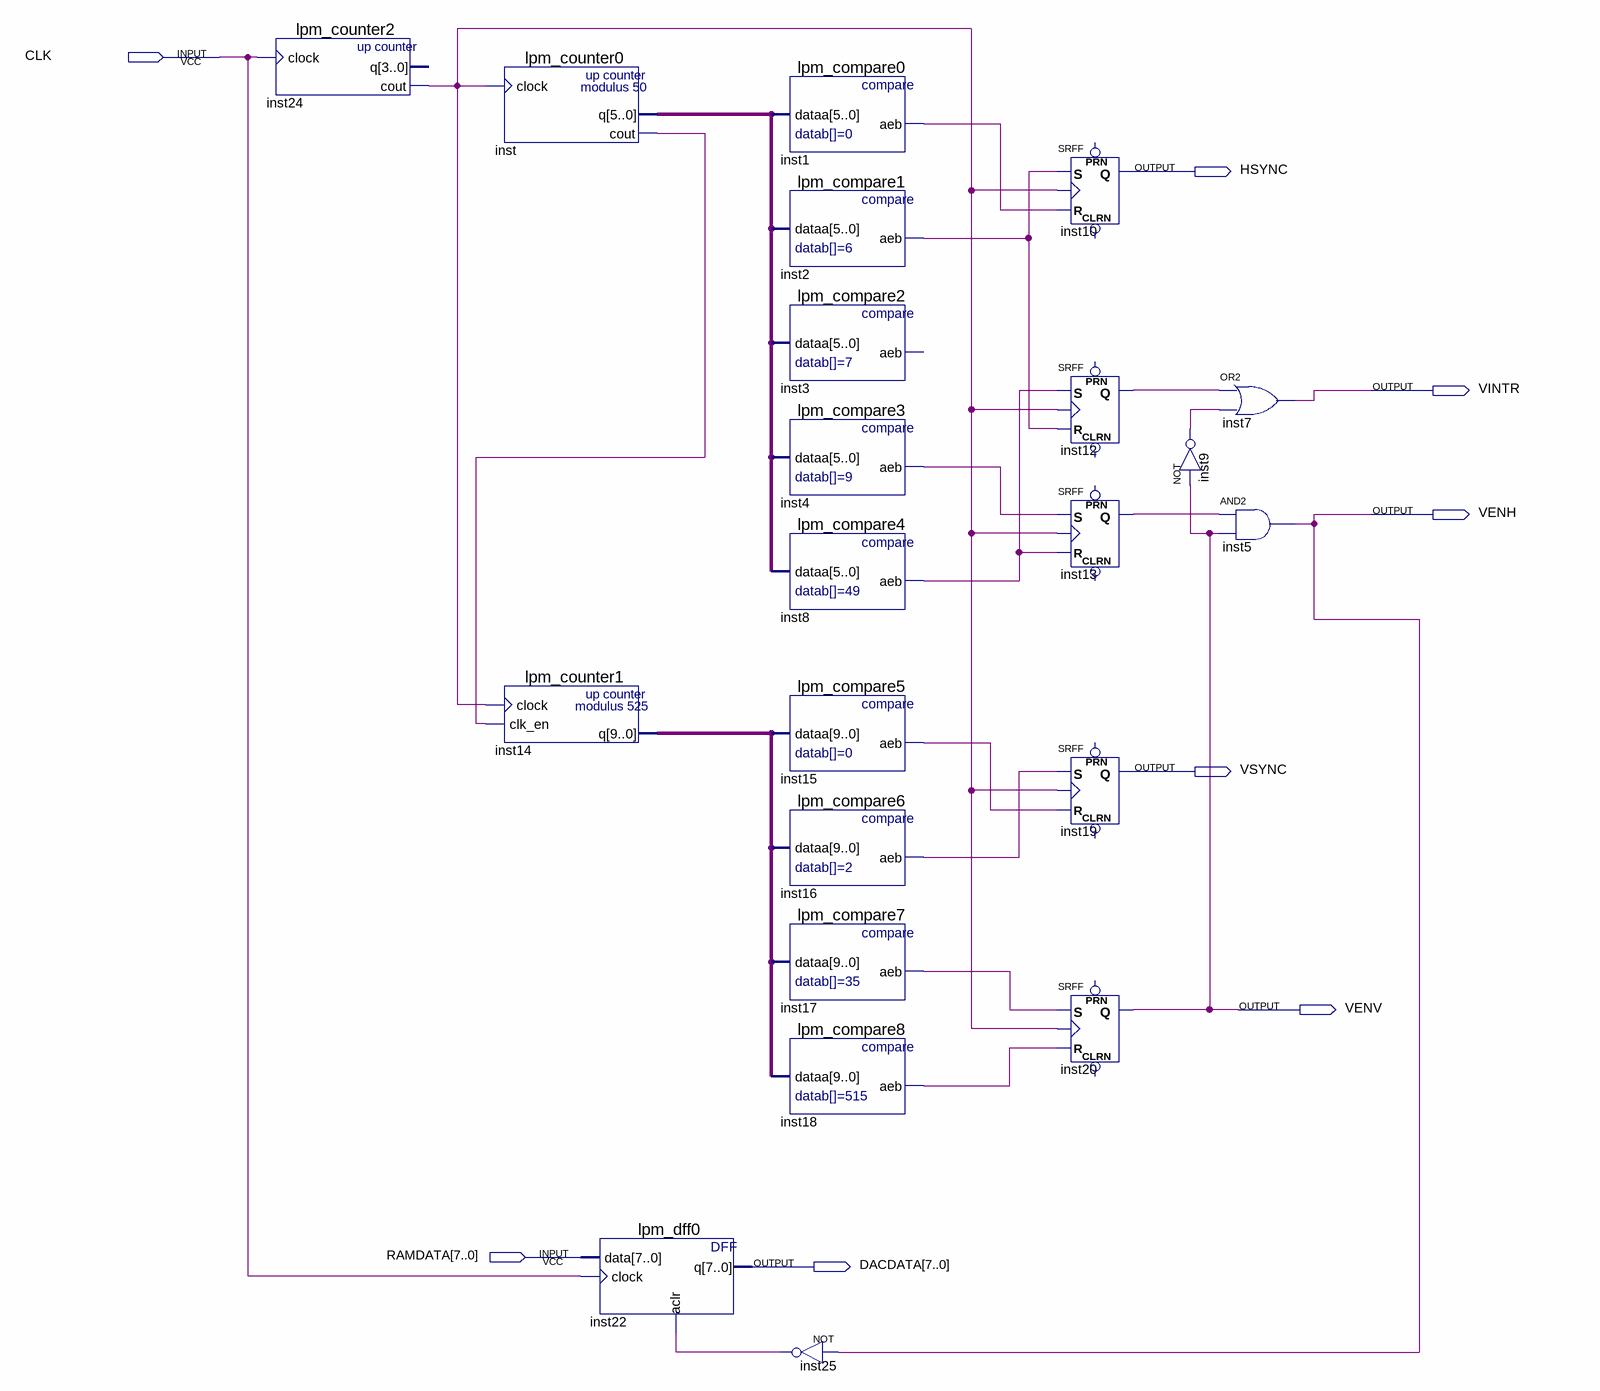
[diagram p0: schematic sheet]
// Quartus schematic VGA1.bdf as structural Verilog: 22 symbols, 8 pins
module VGA1 (
  input  CLK,
  input  [7:0] RAMDATA,
  output HSYNC,
  output VINTR,
  output VENH,
  output VSYNC,
  output VENV,
  output [7:0] DACDATA
);

  wire inst1_aeb, inst2_aeb, inst4_aeb, inst8_aeb, inst9_out, inst12_q, inst13_q, inst15_aeb, inst16_aeb,
       inst17_aeb, inst18_aeb, inst24_cout, inst25_out, inst_cout;
  wire [5:0] inst_q;
  wire [9:0] inst14_q;

  lpm_counter2 inst24 (.clock(CLK), .cout(inst24_cout));  // open: q
  lpm_counter0 inst (.clock(inst24_cout), .q(inst_q), .cout(inst_cout));
  lpm_counter1 inst14 (.clock(inst24_cout), .clk_en(inst_cout), .q(inst14_q));
  lpm_dff0 inst22 (.data(RAMDATA), .clock(CLK), .aclr(inst25_out), .q(DACDATA));
  lpm_compare0 inst1 (.dataa(inst_q), .aeb(inst1_aeb));
  lpm_compare1 inst2 (.dataa(inst_q), .aeb(inst2_aeb));
  lpm_compare2 inst3 (.dataa(inst_q));  // open: aeb
  lpm_compare3 inst4 (.dataa(inst_q), .aeb(inst4_aeb));
  lpm_compare4 inst8 (.dataa(inst_q), .aeb(inst8_aeb));
  lpm_compare5 inst15 (.dataa(inst14_q), .aeb(inst15_aeb));
  lpm_compare6 inst16 (.dataa(inst14_q), .aeb(inst16_aeb));
  lpm_compare7 inst17 (.dataa(inst14_q), .aeb(inst17_aeb));
  lpm_compare8 inst18 (.dataa(inst14_q), .aeb(inst18_aeb));
  not inst25 (inst25_out, VENH);
  SRFF inst10 (.S(inst2_aeb), .R(inst1_aeb), .CLK(inst24_cout), .Q(HSYNC));  // open: PRN, CLRN
  SRFF inst12 (.S(inst8_aeb), .R(inst2_aeb), .CLK(inst24_cout), .Q(inst12_q));  // open: PRN, CLRN
  SRFF inst13 (.S(inst4_aeb), .R(inst8_aeb), .CLK(inst24_cout), .Q(inst13_q));  // open: PRN, CLRN
  SRFF inst19 (.S(inst16_aeb), .R(inst15_aeb), .CLK(inst24_cout), .Q(VSYNC));  // open: PRN, CLRN
  SRFF inst20 (.S(inst17_aeb), .R(inst18_aeb), .CLK(inst24_cout), .Q(VENV));  // open: PRN, CLRN
  or inst7 (VINTR, inst12_q, inst9_out);
  not inst9 (inst9_out, VENV);
  and inst5 (VENH, inst13_q, VENV);
endmodule
